# Altium project PCB_Project.PrjPcb
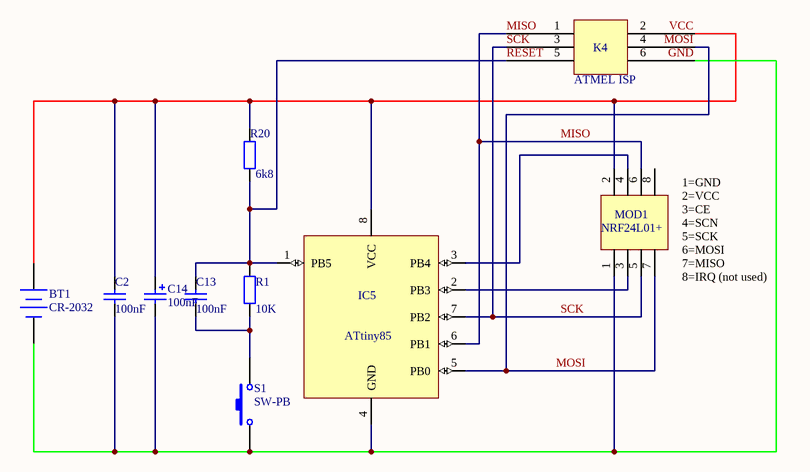
[diagram p0: ZENDER.SchDoc]
2 sheets, 52 parts. Net scope: global (net labels, ports and power ports of the same name join across sheets).
Board files: ZENDER.PcbDoc, ONTVANGER.PcbDoc
Sheets:
  ZENDER.SchDoc
  ONTVANGER.SchDoc

## Sheet ZENDER.SchDoc
size A4

### Parts
BT1  CR-2032  [PANA-CR-2032HFN]
C2  value 100nF  [C1206]  (hidden comment: Cap Semi)
C13  value 100nF  [C1206]  (hidden comment: Cap Semi)
C14  value 100nF  [POLAR0.8]  (hidden comment: Cap Pol2)
IC5  ATtiny85  [*SOIC127P798X216-8N]
K4  ATMEL ISP  [HDR2X3]
MOD1  NRF24L01+  [HDR2X4]
R1  value 10K  [*RESC3115X70N]  (hidden comment: Res2)
R20  value 6k8  [*RESC3216X55N]  (hidden comment: Res2)
S1  SW-PB  [SPST-2]

### Nets
NetBT1_1: BT1.1(+) C2.2 C14.1 IC5.8(VCC) K4.2 MOD1.2 R20.1
NetBT1_2: BT1.2(-) C2.1 C14.2 IC5.4(GND) K4.6 MOD1.1 S1.1
NetC13_1: C13.1 R1.2 S1.2
NetC13_2: C13.2 IC5.1(PB5) K4.5 R1.1 R20.2
NetIC5_2: IC5.2(PB3) MOD1.3
NetIC5_3: IC5.3(PB4) MOD1.4
NetIC5_5: IC5.5(PB0) K4.4 MOD1.7
NetIC5_6: IC5.6(PB1) K4.1 MOD1.6
NetIC5_7: IC5.7(PB2) K4.3 MOD1.5

Not connected (* = marked no-connect by the designer): MOD1 8

### Notes on the sheet
- (near K4) MISO
- (near K4) SCK
- (near K4) RESET
- (near K4) VCC
- (near K4) MOSI
- (near K4) GND
- MISO
- (near MOD1) 1=GND
- (near MOD1) 2=VCC
- (near MOD1) 3=CE
- (near MOD1) 4=SCN
- (near MOD1) 5=SCK
- (near MOD1) 6=MOSI
- (near MOD1) 7=MISO
- SCK
- (near MOD1) 8=IRQ (not used)
- MOSI

### Library data of the parts
BT1 = CMP-2000-05296-1: Coin Cell Battery, 225 mAh, 0.2 mA, 3 V, -30 to 60 degC, Bulk; Manufacturer: Panasonic; SVHC: 1,2-dimethoxyethane,ethyleneglycoldimethylether(EGDME)(15-Jun-2015); Battery Size Code: 2032; Battery Voltage: 3V; Battery IEC Code: CR2032; Battery NEDA Code: 5004LC; External Height: 3.2mm; Battery Terminals: PCBPins; Battery Capacity: 220mAh; External Diameter: 20mm; Battery Technology: LithiumManganeseDioxide; Product Range: -; Datasheet Version: Rev. 0, 05/2010; Manufacturer URL: http://www.panasonic.com/; External Depth: -; Weight: 2.9g; Datasheet URL: https://datasheet.ciiva.com/3/aaa4000de87-3072.pdf; External Width: -
C2 C13 = Cap Semi: Capacitor (Semiconductor SIM Model); Published: 8-Jun-2000; LatestRevisionDate: 29-May-2009; LatestRevisionNote: IPC-7351 Footprint Added.; PackageReference: C1206; Publisher: Altium Limited; PackageDescription: Chip Capacitor
C14 = Cap Pol2: Polarized Capacitor (Axial); Published: 8-Jun-2000; LatestRevisionDate: 17-Jul-2002; LatestRevisionNote: Re-released for DXP Platform.; PackageReference: POLAR0.8; Publisher: Altium Limited; PackageDescription: Polarized Capacitor; 2 Leads
IC5 = CMP-0093-00032-2: 8-bit AVR Microcontroller, 20MHz, 2.7-5.5V, 8K Flash, 512 Bytes EEPROM, 512 Bytes SRAM, Industrial Grade (-40°C to 85°C), 8-Lead PDIP, Pb-Free; Manufacturer: Microchip / Atmel; Manufacturer Part Number: ATTINY85-20PU; PackageVersion: revB, Jan-2002; ComponentLink2URL: http://www.atmel.com/dyn/resources/prod_documents/doc2586.pdf; PackageReference: 8P3; ComponentLink2Description: ATtiny25/45/85 Datasheet; ComponentLink3Description: ATtiny25/45/85 Summary; ComponentLink3URL: http://www.atmel.com/dyn/resources/prod_documents/2586S.pdf; RevisionNote: DatasheetVersion updated. URLs added.; DatasheetVersion: revN, Apr-2011; ComponentLink1Description: Manufacturer URL; Code_JEDEC: MS-001-BA; ComponentLink1URL: http://www.atmel.com/; PackageDescription: 8-Lead, 0.300" Wide Body, Plastic Dual In-Line Package (PDIP)
K4 = Header 3X2: Header, 3-Pin, Dual row; LatestRevisionDate: 17-Jul-2002; LatestRevisionNote: Re-released for DXP Platform.; Publisher: Altium Limited
MOD1 = Header 4X2: Header, 4-Pin, Dual row; LatestRevisionDate: 17-Jul-2002; LatestRevisionNote: Re-released for DXP Platform.; Publisher: Altium Limited
R1 R20 = Res2: Resistor; Published: 8-Jun-2000; LatestRevisionDate: 17-Jul-2002; LatestRevisionNote: Re-released for DXP Platform.; PackageReference: AXIAL-0.4; Publisher: Altium Limited; PackageDescription: Axial Device, Thru-Hole; 2 Leads; 0.4 in Pin Spacing
S1 = SW-PB: Switch; Published: 24-Mar-1999; LatestRevisionDate: 17-Jul-2002; LatestRevisionNote: Re-released for DXP Platform.; PackageReference: SPST-2; Publisher: Altium Limited; PackageDescription: Switch; 2 Leads

## Sheet ONTVANGER.SchDoc
size A4 portrait; Organization: Altium Limited; Address1: L3, 12a Rodborough Rd; Address2: Frenchs Forest; Address3: NSW; Address4: Australia 2086
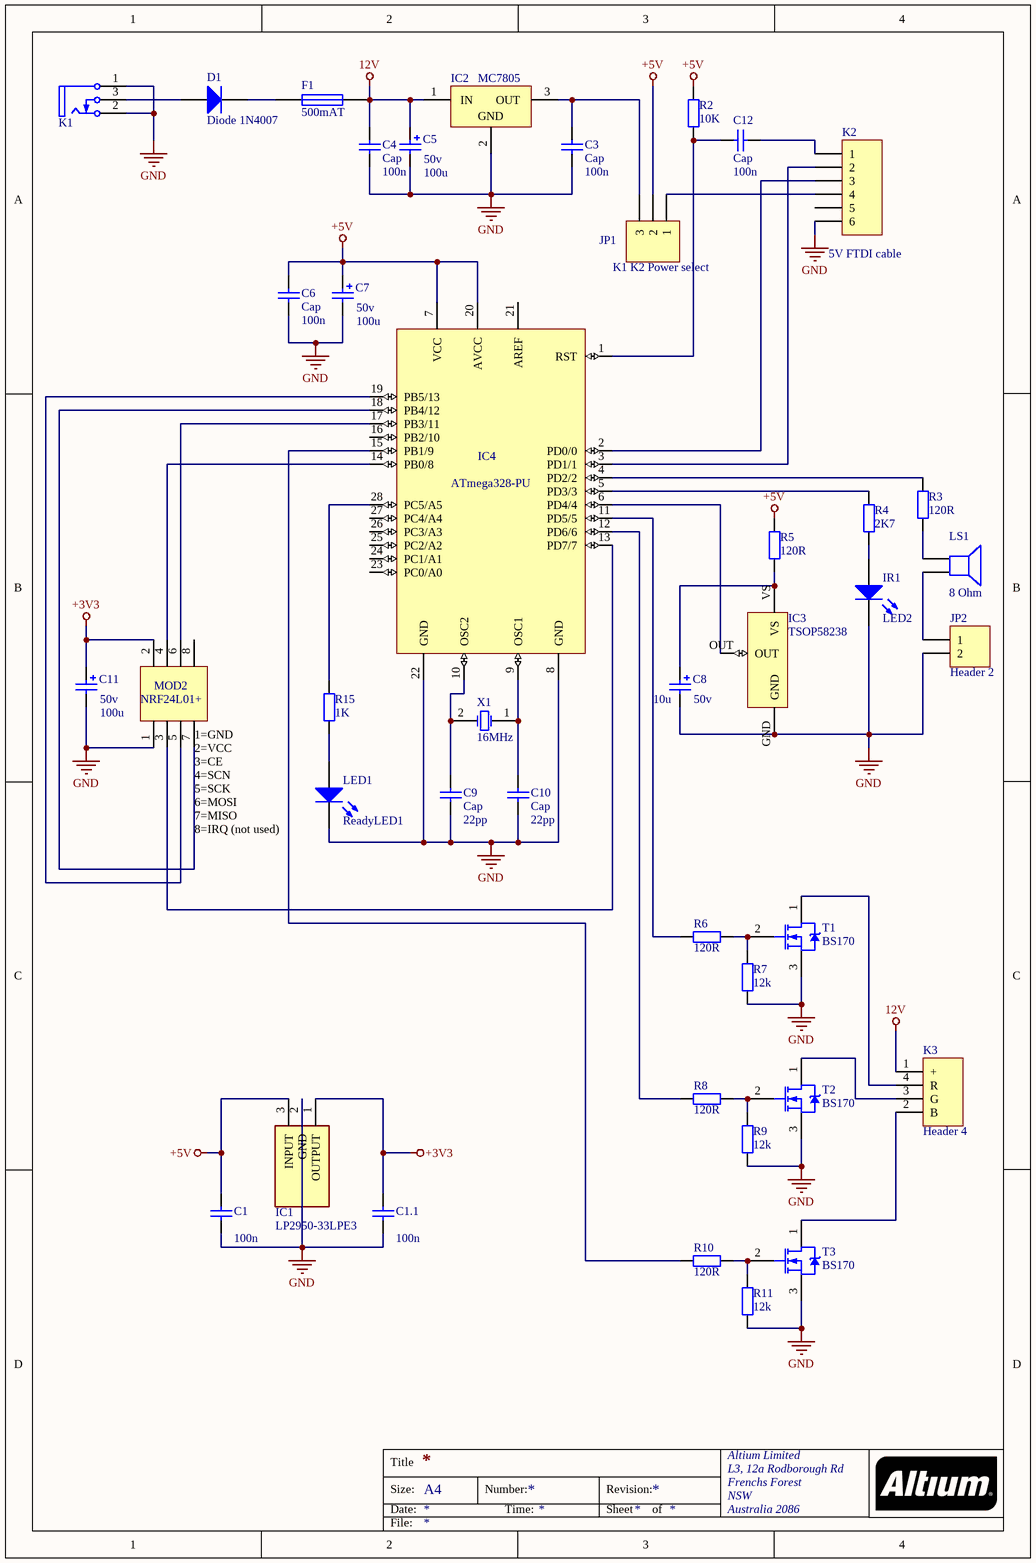
[diagram p1: ONTVANGER.SchDoc]

### Parts
C1  value 100n  [RAD-0.3]  (hidden comment: Cap)
C1.1  value 100n  [RAD-0.3]  (hidden comment: Cap)
C3  Cap  value 100n  [RAD-0.3]
C4  Cap  value 100n  [RAD-0.3]
C5  50v  value 100u  [POLAR0.8]
C6  Cap  value 100n  [RAD-0.3]
C7  50v  value 100u  [POLAR0.8]
C8  50v  value 10u  [POLAR0.8]
C9  Cap  value 22pp  [RAD-0.3]
C10  Cap  value 22pp  [RAD-0.3]
C11  50v  value 100u  [POLAR0.8]
C12  Cap  value 100n  [RAD-0.3]
D1  Diode 1N4007  [DO-41]
F1  500mAT  [PIN-W2/E2.8]
IC1  LP2950-33LPE3  [TO127P419X482X788-3P]
IC2  MC7805  [ONSC-TO-220-3-221AB-01]
IC3  TSOP58238  [*TSOP-382_TSOP38238(Primary)]
IC4  ATmega328-PU  [*DIL28]
IR1  LED2  [LED-0]
JP1  K1 K2 Power select  [HDR1X3]
JP2  Header 2  [HDR1X2]
K1  PJRAN1X1U01X  [SWIT-PJRAN1X1U01X_V]  (value not drawn)
K2  5V FTDI cable  [HDR1X6]
K3  Header 4  [HDR1X4]
LS1  8 Ohm  [PIN2]
MOD2  NRF24L01+  [HDR2X4]
R2  value 10K  [*RESC3115X70N]  (hidden comment: Res2)
R3  value 120R  [*RESC3146X60N]  (hidden comment: Res2)
R4  value 2K7  [*RESC3215X64N]  (hidden comment: Res2)
R5  value 120R  [*RESC3146X60N]  (hidden comment: Res2)
R6  value 120R  [*RESC3146X60N]  (hidden comment: Res2)
R7  value 12k  [*RESC3215X64N]  (hidden comment: Res2)
R8  value 120R  [*RESC3146X60N]  (hidden comment: Res2)
R9  value 12k  [*RESC3215X64N]  (hidden comment: Res2)
R10  value 120R  [*RESC3146X60N]  (hidden comment: Res2)
R11  value 12k  [*RESC3215X64N]  (hidden comment: Res2)
R15  value 1K  [*RESC1412X64N]  (hidden comment: Res2)
ReadyLED1  LED1  [LED-0]
T1  BS170  [ONSC-TO-92-3-29-11]
T2  BS170  [ONSC-TO-92-3-29-11]
T3  BS170  [ONSC-TO-92-3-29-11]
X1  16MHz  [R38]

### Nets
12V: C4.2 C5.1 F1.2 IC2.1(IN) K3.1(+)
+3V3: C1.1.2 C11.1 IC1.1(OUTPUT) MOD2.2
+5V: C1.2 C6.2 C7.1 IC1.3(INPUT) IC4.7(VCC) IC4.20(AVCC) JP1.2 R2.2 R5.2
GND: C1.1 C1.1.1 C3.1 C4.1 C5.2 C6.1 C7.2 C8.2 C9.1 C10.1 C11.2 IC1.2(GND) IC2.2(GND) IC3.GND IC4.8(GND) IC4.22(GND) IR1.2(K) JP2.2 K1.1(SLEEVE) K1.2(TIP) K2.6 MOD2.1 R7.1 R9.1 R11.1 ReadyLED1.2(K) T1.3(S) T2.3(S) T3.3(S)
NetC3_2: C3.2 IC2.3(OUT) JP1.3
NetC8_1: C8.1 IC3.VS R5.1
NetC9_2: C9.2 IC4.10(OSC2) X1.2(OSC2)
NetC10_2: C10.2 IC4.9(OSC1) X1.1(OSC1)
NetC12_1: C12.1 K2.1
NetC12_2: C12.2 IC4.1(RST) R2.1
NetD1_1: D1.1(A) K1.3(SHUNT)
NetD1_2: D1.2(K) F1.1
NetIC3_OUT: IC3.OUT IC4.6(PD4/4)
NetIC4_2: IC4.2(PD0/0) K2.3
NetIC4_3: IC4.3(PD1/1) K2.2
NetIC4_4: IC4.4(PD2/2) R3.2
NetIC4_5: IC4.5(PD3/3) R4.2
NetIC4_11: IC4.11(PD5/5) R6.2
NetIC4_12: IC4.12(PD6/6) R8.2
NetIC4_13: IC4.13(PD7/7) MOD2.3
NetIC4_14: IC4.14(PB0/8) MOD2.4
NetIC4_15: IC4.15(PB1/9) R10.2
NetIC4_17: IC4.17(PB3/11) MOD2.6
NetIC4_18: IC4.18(PB4/12) MOD2.7
NetIC4_19: IC4.19(PB5/13) MOD2.5
NetIC4_28: IC4.28(PC5/A5) R15.2
NetIR1_1: IR1.1(A) R4.1
NetJP1_1: JP1.1 K2.4
NetJP2_1: JP2.1 LS1.2
NetK3_2: K3.2(B) T3.1(D)
NetK3_3: K3.3(G) T2.1(D)
NetK3_4: K3.4(R) T1.1(D)
NetLS1_1: LS1.1 R3.1
NetR6_1: R6.1 R7.2 T1.2(G)
NetR8_1: R8.1 R9.2 T2.2(G)
NetR10_1: R10.1 R11.2 T3.2(G)
NetR15_1: R15.1 ReadyLED1.1(A)

Not connected (* = marked no-connect by the designer): IC4 16(PB2/10) 21(AREF) 23(PC0/A0) 24(PC1/A1) 25(PC2/A2) 26(PC3/A3) 27(PC4/A4); K2 5; MOD2 8

### Notes on the sheet
- (near MOD2) 1=GND
- (near MOD2) 2=VCC
- (near MOD2) 3=CE
- (near MOD2) 4=SCN
- 5=SCK
- 6=MOSI
- 7=MISO
- (near ReadyLED1) 8=IRQ (not used)
- Title
- Size:
- Date:
- A4
- Number:
- Time:
- Revision:
- Sheet
- of
- File:

### Library data of the parts
C1 C1.1 C3 C4 C6 C9 C10 C12 = Cap: Capacitor; Published: 8-Jun-2000; LatestRevisionDate: 17-Jul-2002; LatestRevisionNote: Re-released for DXP Platform.; PackageReference: RAD-0.3; Publisher: Altium Limited; PackageDescription: Radial Cap, Thru-Hole; 2 Leads; 0.3 in Pin Spacing
C5 C7 C8 C11 = Cap Pol2: Polarized Capacitor (Axial); Published: 8-Jun-2000; LatestRevisionDate: 17-Jul-2002; LatestRevisionNote: Re-released for DXP Platform.; PackageReference: POLAR0.8; Publisher: Altium Limited; PackageDescription: Polarized Capacitor; 2 Leads
D1 = Diode 1N4007: 1 Amp General Purpose Rectifier; Published: 8-Jun-2000; LatestRevisionDate: 17-Jul-2002; LatestRevisionNote: Re-released for DXP Platform.; DatasheetVersion: 1998; PackageVersion: Aug-1999; PackageReference: DO-41; Publisher: Altium Limited; PackageDescription: Diode, Axial; Body 5.2 x 2.7 mm (LxDia. max), Lead Dia. 0.86 mm (max); Code_JEDEC: DO-204-AL; ComponentLink1Description: Manufacturer Link; ComponentLink1URL: http://www.fairchildsemi.com/; ComponentLink2Description: Datasheet; ComponentLink2URL: http://www.fairchildsemi.com/ds/1N%2F1N4001.pdf
F1 = Fuse 1: Fuse; Published: 8-Jun-2000; LatestRevisionDate: 17-Jul-2002; LatestRevisionNote: Re-released for DXP Platform.; PackageReference: PIN-W2/E2.8; Publisher: Altium Limited; PackageDescription: Thru-Hole; 2 Leads
IC1 = LP2950-33LPE3: Integrated Circuit; Manufacturer_Name: Texas Instruments; Datasheet Link: http://www.ti.com/lit/gpn/lp2950; Height: 4.19mm; Manufacturer_Part_Number: LP2950-33LPE3; Mouser Part Number: 595-LP2950-33LPE3; Mouser Price/Stock: https://www.mouser.com/Search/Refine.aspx?Keyword=595-LP2950-33LPE3; RS Part Number: 7620430P; RS Price/Stock: http://uk.rs-online.com/web/p/products/7620430P
IC2 = CMP-2000-04928-1: Positive Voltage Regulator, 1 A, 5 V, 0 to 125 degC, 3-Pin TO-220, RoHS, Tube; Manufacturer: ON Semiconductor; Resistance, Thermal, Junction to Case: 5degC/W; Voltage, Supply: 35V; Regulator Function: Standard; Temperature, Operating, Maximum: +125degC; Load Regulation: 25mV; Regulator Type: PositiveVoltageOut; Current, Output, Maximum: 1A; Regulation, Load: 1.3mV; Number of Outputs: 1; Temperature, Operating, Range: 0to+125degC; Regulation, Line: 0.5mV; Line Regulation: 20mV; Voltage, Input Range: Maximumof35V; Output Type: Fixed; Current, Quiescent Supply: 6.5mA; Dropout Voltage: 2V; Temperature, Operating, Minimum: 0degC; Package Version: Rev. A, 11/2010; Current, Supply: 3.2mA; Voltage, Output: 5V; Voltage, Noise: 10μV/V; Package Type: TO-220; Voltage, Input, High Level: 35V; Datasheet URL: http://www.onsemi.com/pub_link/Collateral/MC7800-D.PDF; Dimensions: 10.28x4.82x15.75mm; Width: 4.82mm; Type: VoltageRegulator; Mounting Type: ThroughHole; Polarity: Positive; Datasheet Version: Rev. 27, 11/2014; Height: 15.75mm; Dropout Voltage Measurement Current: 1A; Package Description: 3-Pin Flange Mount, Vertical Straight Lead, Body 9.97 x 4.445 mm, Pitch 2.54 mm; Manufacturer URL: http://www.onsemi.com/; Voltage, Dropout: 2V; Length: 10.28mm; Number of Pins: 3; Package Reference: TO-220-3-221AB-01
IC3 = CMP-1666-00022-1: IR Receiver Modules for Remote Control System, 2.5 to 5.5 V, -25 to 85 degC, 3-Pin THD, RoHS, Bulk; Manufacturer: Vishay; Manufacturer: Vishay Semiconductors; Manufacturer Part Number: TSOP38238; Tolerance: 30ppm; ESR: 40 Ohm; Capacitance: 1.8E-11 f; Frequency: 24 MHz; Load Capacitance: 18 pF; Min Supply Voltage: 2.5V; Max Supply Voltage: 5.5V; Sensing Distance: 40m; Operating Supply Current: 700uA; DatasheetVersion: Rev. 1.5, 07/2016; REACH SVHC: No SVHC; Frequency Tolerance: 30ppm; ComponentLink2URL: http://www.vishay.com/docs/82491/tsop382.pdf; Mount: Surface Mount; Length: 0.197 inch; Min Operating Temperature: -20degC; Packaging: Tape and Reel; ComponentLink1URL: http://www.vishay.com/; Width: 0.126 inch; Height: 0.041 inch; PackageDescription: 3-Pin Through Hole Device, Body 5.00 x 4.80 mm, Pitch 2.54 mm; Max Operating Temperature: 70degC; Pins: 4; RoHSCompliant: True; Package Quantity: 1000; PackageReference: VISH-TSOP38238; ComponentLink2Description: Datasheet; ComponentLink1Description: Manufacturer URL; Resistance: 40 Ohm; Supplier 1: Digi-Key; Manufacturer Part Number: TSOP58238; RoHS: Yes; Category: Diodes; Stock 1: 1485; Pricing 1: 1=0,95000, 10=0,83700, 25=0,75600, 100=0,66150, 250=0,58052, 500=0,51300, 1000=0,40500, 5000=0,35910, 10000=0,34425 (USD); Number of Pins: 3; Orientation: Side View; Nominal Supply Current: 700uA; Lead Free: Lead Free; ComponentLink3URL: https://datasheet.ciiva.com/15272/tsop582-15272159.pdf?src-supplier=Arrow+Europe; ComponentLink3Description: https://datasheet.ciiva.com/15272/tsop582-15272159.pdf?src-supplier=Arrow+Europe; ComponentLink4URL: https://datasheet.ciiva.com/8078/tsop582-8078165.pdf?src-supplier=Element14; ComponentLink4Description: https://datasheet.ciiva.com/8078/tsop582-8078165.pdf?src-supplier=Element14; ComponentLink5URL: https://datasheet.ciiva.com/8084/tsop582-8084506.pdf?src-supplier=Avnet; ComponentLink5Description: https://datasheet.ciiva.com/8084/tsop582-8084506.pdf?src-supplier=Avnet; ComponentLink6URL: https://datasheet.ciiva.com/29167/geninfo-29167706.pdf?src-supplier=Digi-Key; ComponentLink6Description: https://datasheet.ciiva.com/29167/geninfo-29167706.pdf?src-supplier=Digi-Key
IC4 = CMP-0095-00015-2: 8-bit AVR Microcontroller, 32KB Flash, 1KB EEPROM, 2KB SRAM, 28-pin PDIP, Industrial Grade (-40°C to 85°C); Manufacturer: Microchip / Atmel; ComponentLink3Description: ATmega48A/48PA/88A/88PA/168A/168PA/328/328P Summary; RevisionNote: DatasheetVersion updated. URLs added.; DatasheetVersion: revD, May-2011; ComponentLink1URL: http://www.atmel.com/; PackageVersion: revB, Sep-2001; PackageDescription: 28-lead (0.300"/7.62mm Wide) Plastic Dual Inline Package (PDIP); PackageReference: 28P3; ComponentLink1Description: Manufacturer URL; ComponentLink2Description: ATmega48A/48PA/88A/88PA/168A/168PA/328/328P Datasheet; ComponentLink3URL: http://www.atmel.com/dyn/resources/prod_documents/8271S.pdf; ComponentLink2URL: http://www.atmel.com/dyn/resources/prod_documents/8271.pdf; Manufacturer Part Number: ATMEGA328-PU
IR1 ReadyLED1 = LED0: Typical INFRARED GaAs LED; Published: 8-Jun-2000; LatestRevisionDate: 08-Jul-2005; LatestRevisionNote: Mech Layer 1 removed.; PackageReference: LED-0; Publisher: Altium Limited; PackageDescription: LED; 2 Leads
JP1 = Header 3: Header, 3-Pin; LatestRevisionDate: 17-Jul-2002; LatestRevisionNote: Re-released for DXP Platform.; Publisher: Altium Limited
JP2 = Header 2: Header, 2-Pin; LatestRevisionDate: 17-Jul-2002; LatestRevisionNote: Re-released for DXP Platform.; Publisher: Altium Limited
K1 = CMP-1772-00003-1: Female Phono Jack, 3 Position, Height 13 mm, Tail Length 4 mm, RoHS, Bulk; Case\Package: Radial; Type (Capacitors): X7R; Tolerance: 10%; Voltage Rating (DC): 50 V; Capacitance: 100 nF; Package Quantity: 500; Mount: Through Hole; Packaging: Bulk; Height: 3.18 mm; Min Operating Temperature: -55 degC; Radiation Hardening: No; PackageDescription: Female Phono Jack, 3 Position, Height 13 mm, Tail Length 4 mm; Length: 6.6 mm; Lead Pitch: 2.54 mm; Width: 5.08 mm; REACH SVHC: No SVHC; ComponentLink1Description: Manufacturer URL; Max Operating Temperature: 125 degC; ComponentLink2Description: Datasheet; DatasheetVersion: Rev. A, 01/2006; Voltage Rating: 50 V; ComponentLink2URL: http://www.conxall.com/Drawings/pjran1x1u__x_series_cd.pdf; ComponentLink1URL: http://www.switchcraft.com/; RoHSCompliant: true; Pins: 2; PackageReference: PJRAN1X1U01X
K2 = Header 6: Header, 6-Pin; LatestRevisionDate: 17-Jul-2002; LatestRevisionNote: Re-released for DXP Platform.; Publisher: Altium Limited
K3 = Header 4: Header, 4-Pin; LatestRevisionDate: 17-Jul-2002; LatestRevisionNote: Re-released for DXP Platform.; Publisher: Altium Limited
LS1 = Speaker: Loudspeaker; Published: 24-Mar-1999; LatestRevisionDate: 17-Jul-2002; LatestRevisionNote: Re-released for DXP Platform.; PackageReference: PIN2; Publisher: Altium Limited
MOD2 = Header 4X2: Header, 4-Pin, Dual row; LatestRevisionDate: 17-Jul-2002; LatestRevisionNote: Re-released for DXP Platform.; Publisher: Altium Limited
R2-R11 R15 = Res2: Resistor; Published: 8-Jun-2000; LatestRevisionDate: 17-Jul-2002; LatestRevisionNote: Re-released for DXP Platform.; PackageReference: AXIAL-0.4; Publisher: Altium Limited; PackageDescription: Axial Device, Thru-Hole; 2 Leads; 0.4 in Pin Spacing
T1-T3 = CMP-1058-00929-1: Small Signal MOSFET, 500 mA, 60 V, N-Channel, 3-Pin TO-92, Bulk Box; Manufacturer: On Semiconductor; VGS Max (V): 20; Configuration: Single; PD Max (W): 0.35; VGS(th) Max (V): 3; ID Max (A): 0.5; V(BR)DSS Min (V): 60; Channel Polarity: N Channel; PackageDescription: 3-Pin Transistor Outline, Body 4.825 x 3.685 mm, Pitch 1.27 mm; Package Type: TO-92; ComponentLink1Description: Manufacturer URL; ComponentLink1URL: http://www.onsemi.com/; DatasheetVersion: Rev. 6; ComponentLink3Description: Package Specification; PartNumber: BS170; ComponentLink2URL: http://www.onsemi.com/pub_link/Collateral/BS170-D.PDF; PackageVersion: Rev. AM; Mounting Technology: Through Hole; PackageReference: TO-92-3-29-11_AM_SL; ComponentLink2Description: Datasheet; ComponentLink3URL: http://www.onsemi.cn/pub_link/Collateral/2N6426-D.PDF; Packing: Bulk Box
X1 = XTAL: RALTRON - AS-16.000-18 - CRYSTAL, 16MHZ, 18PF, HC-49S; Manufacturer: Raltron Electronics; Frequency Tolerance: 50ppm; Series Resistance: 40R; Published: 8-Jun-2000; LatestRevisionDate: 17-Jul-2002; LatestRevisionNote: Re-released for DXP Platform.; PackageReference: R38; Publisher: Altium Limited; PackageDescription: Crystal, Thru-Hole; 2 Leads; Body 3.1 x 8.2 mm (Dia.xH); Supplier 1: Digi-Key; Manufacturer Part Number: AS-16.000-18; RoHS: Yes; Category: Crystals; Stock 1: 1917; Pricing 1: 1=0,66000, 10=0,55000, 50=0,49500, 100=0,44000, 500=0,41800, 1000=0,35200, 2500=0,33000, 5000=0,31900, 10000=0,30800 (USD); Mount: Through Hole; Number of Pins: 2; Min Operating Temperature: -20°C; Max Operating Temperature: 70°C; Frequency: 16MHz; Load Capacitance: 18pF; Frequency Stability: 50ppm; ESR (Equivalent Series Resistance): 40R; Length: 11.35mm; Height: 3.5mm; Width: 5mm; REACH SVHC: No SVHC; ComponentLink1URL: https://datasheet.ciiva.com/46643/70417478-46643322.pdf?src-supplier=Allied+Electronics; ComponentLink1Description: https://datasheet.ciiva.com/46643/70417478-46643322.pdf?src-supplier=Allied+Electronics